# Altium schematic sheet ROS Robot main board.SchDoc: ROS Robot Main Board
size A3; ApprovedBy: Samyar Sadat Akhavi; CheckedBy: Samyar Sadat Akhavi; Author: Samyar Sadat Akhavi; CompanyName: Samyar Projects; DrawnBy: Samyar Sadat Akhavi; Engineer: Samyar Sadat Akhavi; Organization: Samyar Projects; DocumentNumber: 1; Revision: 1.0; SheetNumber: 1; SheetTotal: 1
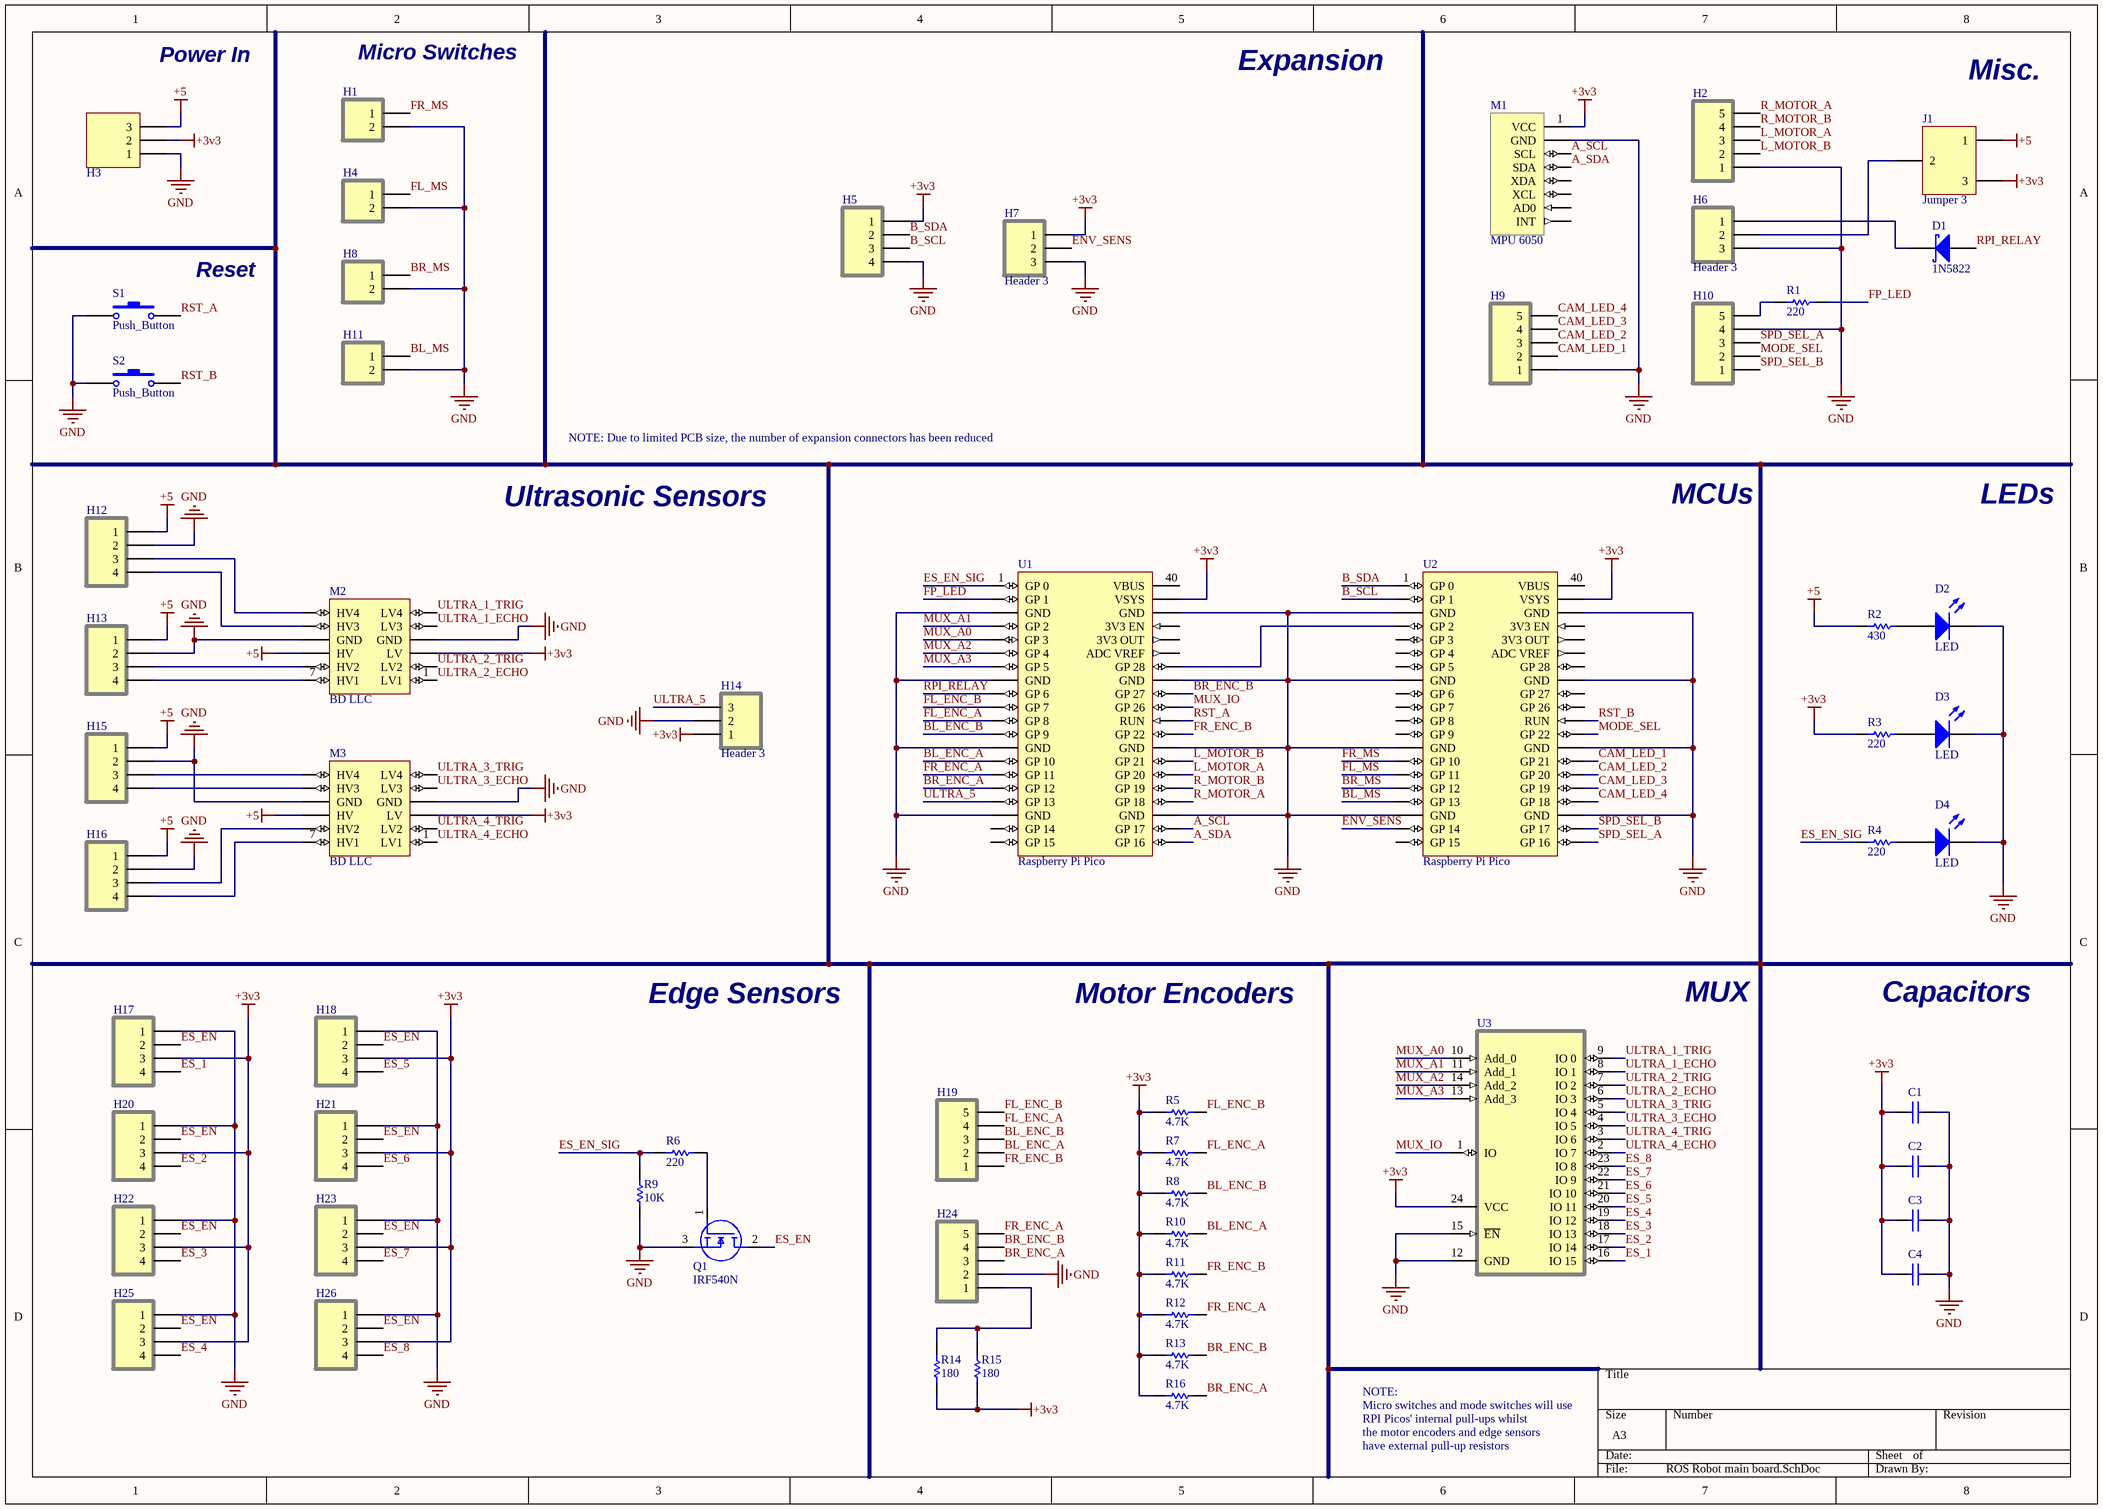
[diagram p0: ROS Robot main board.SchDoc]

## Parts
C1  104  [CAP_SMD_1206]  (value not drawn)
C2  104  [CAP_SMD_1206]  (value not drawn)
C3  104  [CAP_SMD_1206]  (value not drawn)
C4  104  [CAP_SMD_1206]  (value not drawn)
D1  1N5822  [DIODE_SS34]
D2  LED  [LED_1206]
D3  LED  [LED_1206]
D4  LED  [LED_1206]
H1  Header 2  [MOKHABERATI2]  (value not drawn)
H2  Header 5  [mokhaberati5]  (value not drawn)
H3  3 Pin Terminal  [Terminal 3]  (value not drawn)
H4  Header 2  [MOKHABERATI2]  (value not drawn)
H5  Header 4  [mokhaberati4]  (value not drawn)
H6  Header 3  [mokhaberati3]
H7  Header 3  [mokhaberati3]
H8  Header 2  [MOKHABERATI2]  (value not drawn)
H9  Header 5  [mokhaberati5]  (value not drawn)
H10  Header 5  [mokhaberati5]  (value not drawn)
H11  Header 2  [MOKHABERATI2]  (value not drawn)
H12  Header 4  [mokhaberati4]  (value not drawn)
H13  Header 4  [mokhaberati4]  (value not drawn)
H14  Header 3  [mokhaberati3]
H15  Header 4  [mokhaberati4]  (value not drawn)
H16  Header 4  [mokhaberati4]  (value not drawn)
H17  Header 4  [mokhaberati4]  (value not drawn)
H18  Header 4  [mokhaberati4]  (value not drawn)
H19  Header 5  [mokhaberati5]  (value not drawn)
H20  Header 4  [mokhaberati4]  (value not drawn)
H21  Header 4  [mokhaberati4]  (value not drawn)
H22  Header 4  [mokhaberati4]  (value not drawn)
H23  Header 4  [mokhaberati4]  (value not drawn)
H24  Header 5  [mokhaberati5]  (value not drawn)
H25  Header 4  [mokhaberati4]  (value not drawn)
H26  Header 4  [mokhaberati4]  (value not drawn)
J1  Jumper 3  [Jumper Selector]
M1  MPU 6050  [MPU6050 Module]
M2  BD LLC  [Bi-directional logic level coverter]
M3  BD LLC  [Bi-directional logic level coverter]
Q1  IRF540N  [TO254P469X1042X1967-3P]
R1  220  [RES_1206_new]
R2  430  [RES_1206_new]
R3  220  [RES_1206_new]
R4  220  [RES_1206_new]
R5  4.7K  [res_1206_new]
R6  220  [res_1206_new]
R7  4.7K  [res_1206_new]
R8  4.7K  [res_1206_new]
R9  10K  [res_1206_new]
R10  4.7K  [res_1206_new]
R11  4.7K  [res_1206_new]
R12  4.7K  [res_1206_new]
R13  4.7K  [res_1206_new]
R14  180  [res_1206_new]
R15  180  [res_1206_new]
R16  4.7K  [res_1206_new]
S1  Push_Button  [pUSH_bUttOn_4pin_smd]
S2  Push_Button  [pUSH_bUttOn_4pin_smd]
U1  Raspberry Pi Pico  [Raspberry Pi Pico]
U2  Raspberry Pi Pico  [Raspberry Pi Pico]
U3  4067  [4067_SMD]  (value not drawn)

## Nets
+3v3: C1.2 C2.2 C3.2 C4.2 H3.2 H5.1 H7.1 H14.1 H17.3 H18.3 H20.3 H21.3 H22.3 H23.3 H25.3 H26.3 J1.3 M1.1(VCC) M2.3(LV) M3.3(LV) R3.2 R5.2 R7.2 R8.2 R10.2 R11.2 R12.2 R13.2 R14.2 R15.2 R16.2 U1.39(VSYS) U2.39(VSYS) U3.24(VCC)
+5: H3.3 H12.1 H13.1 H15.1 H16.1 J1.1 M2.9(HV) M3.9(HV) R2.2
GND: C1.1 C2.1 C3.1 C4.1 D2.2(K) D3.2(K) D4.2(K) H1.2 H2.1 H3.1 H4.2 H5.4 H6.3 H7.3 H8.2 H9.1 H10.4 H11.2 H12.2 H13.2 H14.2 H15.2 H16.2 H17.1 H18.1 H20.1 H21.1 H22.1 H23.1 H24.2 H25.1 H26.1 M1.2(GND) M2.4(GND) M2.10(GND) M3.4(GND) M3.10(GND) Q1.3(S) R9.1 S1.1 S2.1 U1.3(GND) U1.8(GND) U1.13(GND) U1.18(GND) U1.23(GND) U1.28(GND) U1.33(GND) U1.38(GND) U2.3(GND) U2.8(GND) U2.13(GND) U2.18(GND) U2.23(GND) U2.28(GND) U2.33(GND) U2.38(GND) U3.12(GND) U3.15(~{EN})
A_SCL: M1.3(SCL) U1.22(GP_17)
A_SDA: M1.4(SDA) U1.21(GP_16)
B_SCL: H5.3 U2.2(GP_1)
B_SDA: H5.2 U2.1(GP_0)
BL_ENC_A: H19.2 R10.1 U1.14(GP_10)
BL_ENC_B: H19.3 R8.1 U1.12(GP_9)
BL_MS: H11.1 U2.17(GP_13)
BR_ENC_A: H24.3 R16.1 U1.16(GP_12)
BR_ENC_B: H24.4 R13.1 U1.32(GP_27)
BR_MS: H8.1 U2.16(GP_12)
CAM_LED_1: H9.2 U2.27(GP_21)
CAM_LED_2: H9.3 U2.26(GP_20)
CAM_LED_3: H9.4 U2.25(GP_19)
CAM_LED_4: H9.5 U2.24(GP_18)
ENV_SENS: H7.2 U2.19(GP_14)
ES_1: H17.4 U3.16(IO_15)
ES_2: H20.4 U3.17(IO_14)
ES_3: H22.4 U3.18(IO_13)
ES_4: H25.4 U3.19(IO_12)
ES_5: H18.4 U3.20(IO_11)
ES_6: H21.4 U3.21(IO_10)
ES_7: H23.4 U3.22(IO_9)
ES_8: H26.4 U3.23(IO_8)
ES_EN: H17.2 H18.2 H20.2 H21.2 H22.2 H23.2 H25.2 H26.2 Q1.2(D)
ES_EN_SIG: R4.2 R6.2 R9.2 U1.1(GP_0)
FL_ENC_A: H19.4 R7.1 U1.11(GP_8)
FL_ENC_B: H19.5 R5.1 U1.10(GP_7)
FL_MS: H4.1 U2.15(GP_11)
FP_LED: R1.1 U1.2(GP_1)
FR_ENC_A: H24.5 R12.1 U1.15(GP_11)
FR_ENC_B: H19.1 R11.1 U1.29(GP_22)
FR_MS: H1.1 U2.14(GP_10)
L_MOTOR_A: H2.3 U1.26(GP_20)
L_MOTOR_B: H2.2 U1.27(GP_21)
MODE_SEL: H10.2 U2.29(GP_22)
MUX_A0: U1.5(GP_3) U3.10(Add_0)
MUX_A1: U1.4(GP_2) U3.11(Add_1)
MUX_A2: U1.6(GP_4) U3.14(Add_2)
MUX_A3: U1.7(GP_5) U3.13(Add_3)
MUX_IO: U1.31(GP_26) U3.1(IO)
R_MOTOR_A: H2.5 U1.24(GP_18)
R_MOTOR_B: H2.4 U1.25(GP_19)
RPI_RELAY: D1.1(A) U1.9(GP_6)
RST_A: S1.2 U1.30(RUN)
RST_B: S2.2 U2.30(RUN)
SPD_SEL_A: H10.3 U2.21(GP_16)
SPD_SEL_B: H10.1 U2.22(GP_17)
ULTRA_1_ECHO: M2.5(LV3) U3.8(IO_1)
ULTRA_1_TRIG: M2.6(LV4) U3.9(IO_0)
ULTRA_2_ECHO: M2.1(LV1) U3.6(IO_3)
ULTRA_2_TRIG: M2.2(LV2) U3.7(IO_2)
ULTRA_3_ECHO: M3.5(LV3) U3.4(IO_5)
ULTRA_3_TRIG: M3.6(LV4) U3.5(IO_4)
ULTRA_4_ECHO: M3.1(LV1) U3.2(IO_7)
ULTRA_4_TRIG: M3.2(LV2) U3.3(IO_6)
ULTRA_5: H14.3 U1.17(GP_13)
NetD1_2: D1.2(K) H6.1
NetD2_1: D2.1(A) R2.1
NetD3_1: D3.1(A) R3.1
NetD4_1: D4.1(A) R4.1
NetH6_2: H6.2 J1.2
NetH10_5: H10.5 R1.2
NetH12_3: H12.3 M2.12(HV4)
NetH12_4: H12.4 M2.11(HV3)
NetH13_3: H13.3 M2.8(HV2)
NetH13_4: H13.4 M2.7(HV1)
NetH15_3: H15.3 M3.12(HV4)
NetH15_4: H15.4 M3.11(HV3)
NetH16_3: H16.3 M3.8(HV2)
NetH16_4: H16.4 M3.7(HV1)
NetH24_1: H24.1 R14.1 R15.1
NetQ1_1: Q1.1(G) R6.1
NetU1_34: U1.34(GP_28) U2.4(GP_2)

Not connected (* = marked no-connect by the designer): M1 5(XDA) 6(XCL) 7(AD0) 8(INT); U1 19(GP_14) 20(GP_15) 35(ADC_VREF) 36(3V3_OUT) 37(3V3_EN) 40(VBUS); U2 5(GP_3) 6(GP_4) 7(GP_5) 9(GP_6) 10(GP_7) 11(GP_8) 12(GP_9) 20(GP_15) 31(GP_26) 32(GP_27) 34(GP_28) 35(ADC_VREF) 36(3V3_OUT) 37(3V3_EN) 40(VBUS)

## Notes on the sheet
- Power In
- (near H1) Micro Switches
- Expansion
- (near J1) Misc.
- (near S1) Reset
- NOTE: Due to limited PCB size, the number of expansion connectors has been reduced
- Ultrasonic Sensors
- MCUs
- LEDs
- Edge Sensors
- Motor Encoders
- MUX
- Capacitors
- NOTE:
- Micro switches and mode switches will use
- RPI Picos' internal pull-ups whilst
- the motor encoders and edge sensors
- have external pull-up resistors

## Library data of the parts
C1-C4 = adasi: Capacitor; طراحی توسط: مهندس محمد رفیعی; کانال تلگرام: @Pishnam; وب سایت: www.Pishnam.com
D1 = 1N5822: Schottky Diode; طراحی توسط: مهندس محمد رفیعی; کانال تلگرام: @Pishnam; وب سایت: www.Pishnam.com
D2 D3 = LED: Orange LED; طراحی توسط: مهندس محمد رفیعی; کانال تلگرام: @Pishnam; وب سایت: www.Pishnam.com
D4 = LED: Blue LED; طراحی توسط: مهندس محمد رفیعی; کانال تلگرام: @Pishnam; وب سایت: www.Pishnam.com
H1 H4 H8 H11 = Header 2: Header, 2-Pin; طراحی توسط: مهندس محمد رفیعی; کانال تلگرام: @Pishnam; وب سایت: www.Pishnam.com
H2 H9 H10 H19 H24 = Header 5: طراحی توسط: مهندس محمد رفیعی; کانال تلگرام: @Pishnam; وب سایت: www.Pishnam.com
H3 = Terminal 3
H5 H12 H13 H15-H18 H20-H23 H25 H26 = Header 4: Header, 4-Pin; طراحی توسط: مهندس محمد رفیعی; کانال تلگرام: @Pishnam; وب سایت: www.Pishnam.com
H6 H7 H14 = Header 3: Header, 3-Pin; طراحی توسط: مهندس محمد رفیعی; کانال تلگرام: @Pishnam; وب سایت: www.Pishnam.com
J1 = Jumper 3: 3 Pin jumper
M1 = MPU 6050: MPU 6050 module
M2 M3 = Logic Level Converter: Bi-directional 4 channel logic level converter
Q1 = IRF540N: MOSFET (N-Channel); Manufacturer_Name: Infineon; Datasheet Link: http://uk.rs-online.com/web/p/products/3713068; Height: 4.69mm; Manufacturer_Part_Number: IRF540N
R1-R16 = Resistor: طراحی توسط: مهندس محمد رفیعی; کانال تلگرام: @Pishnam; وب سایت: www.Pishnam.com
S1 S2 = Push_Button: طراحی توسط: مهندس محمد رفیعی; کانال تلگرام: @Pishnam; وب سایت: www.Pishnam.com
U1 U2 = Raspberry Pi Pico: The Raspberry Pi Pico board containing the RP2040 microcontroller
U3 = 4067: Analog Multiplexer/Demultiplexer; طراحی توسط: مهندس محمد رفیعی; کانال تلگرام: @Pishnam; وب سایت: www.Pishnam.com